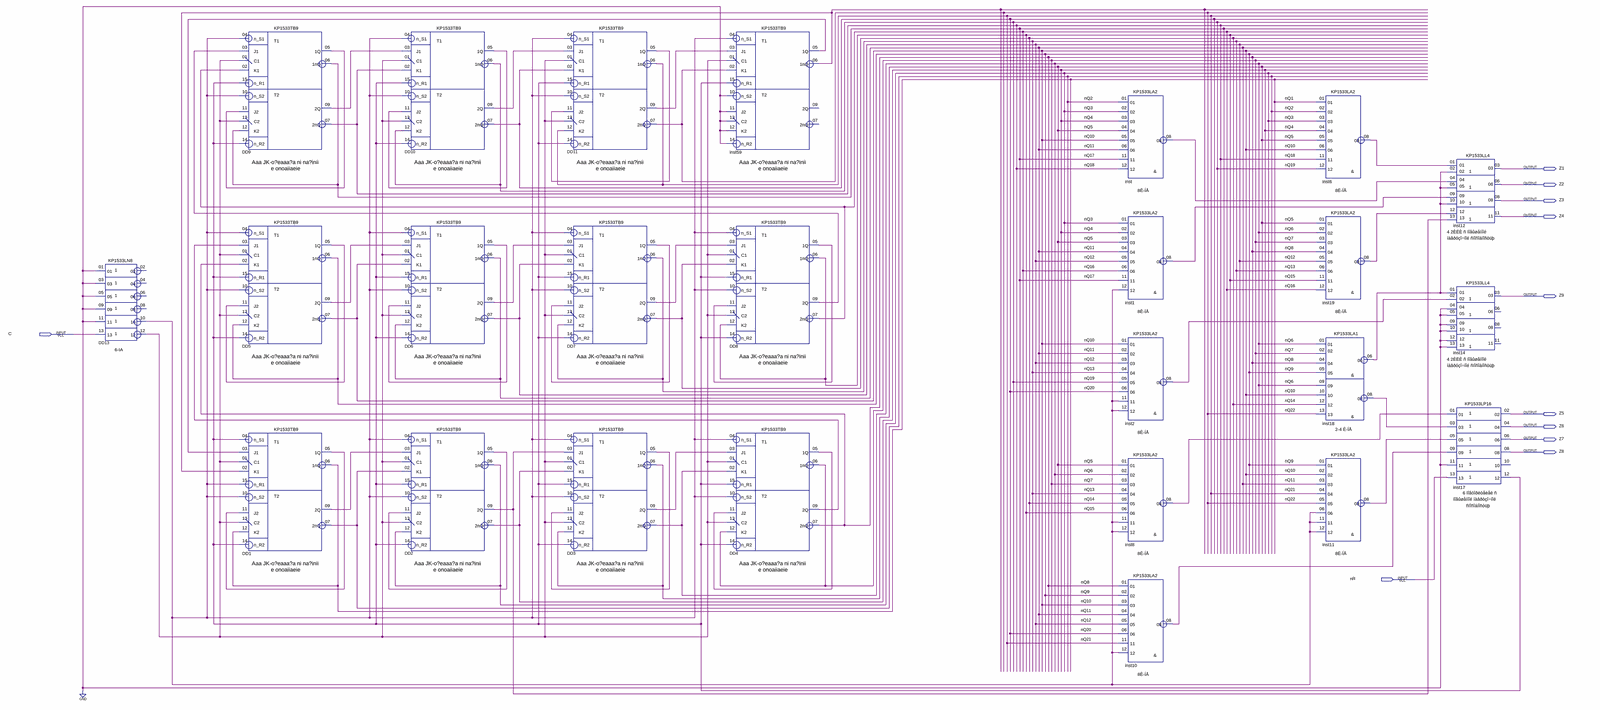
[diagram p0: schematic sheet, whole]
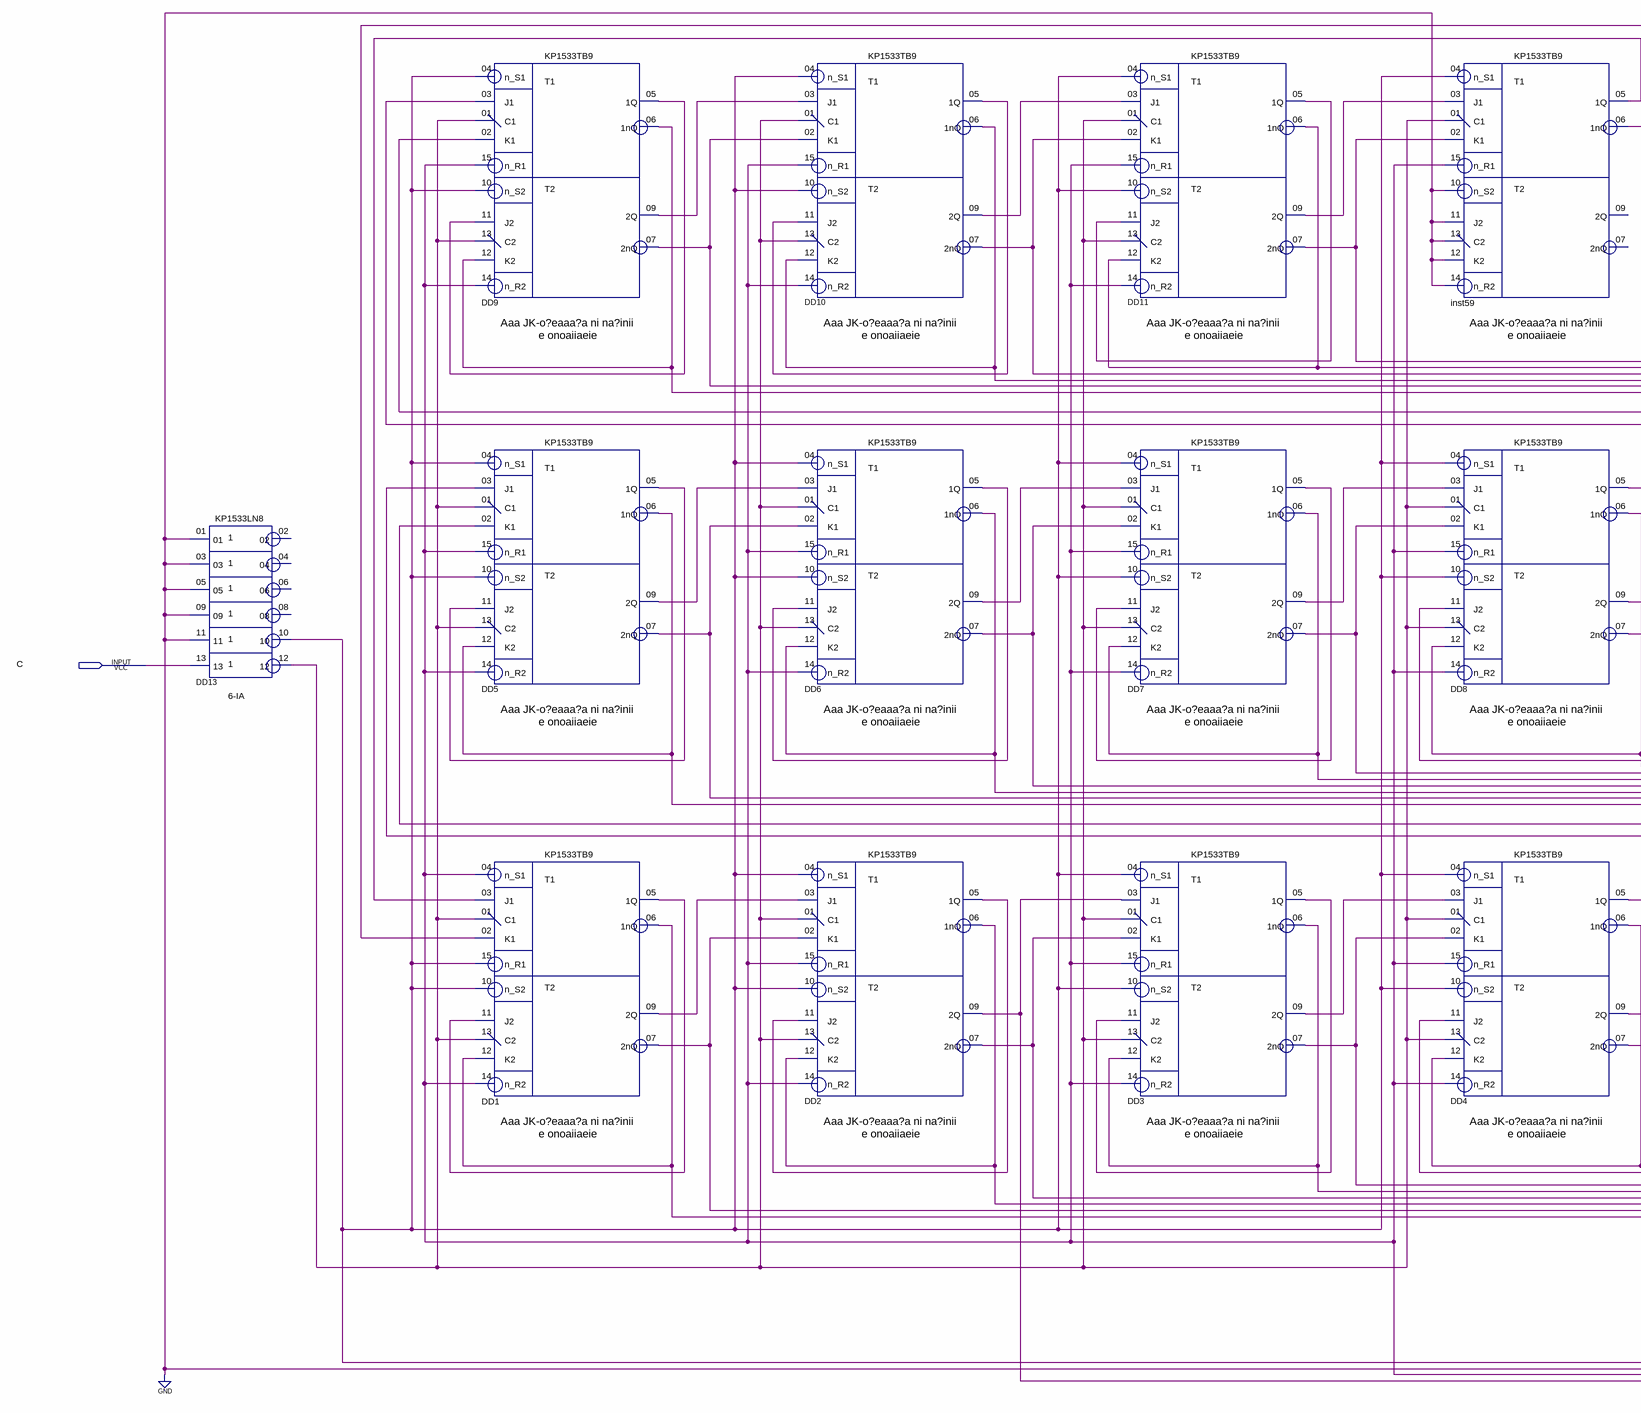
[diagram p1: schematic sheet, left part]
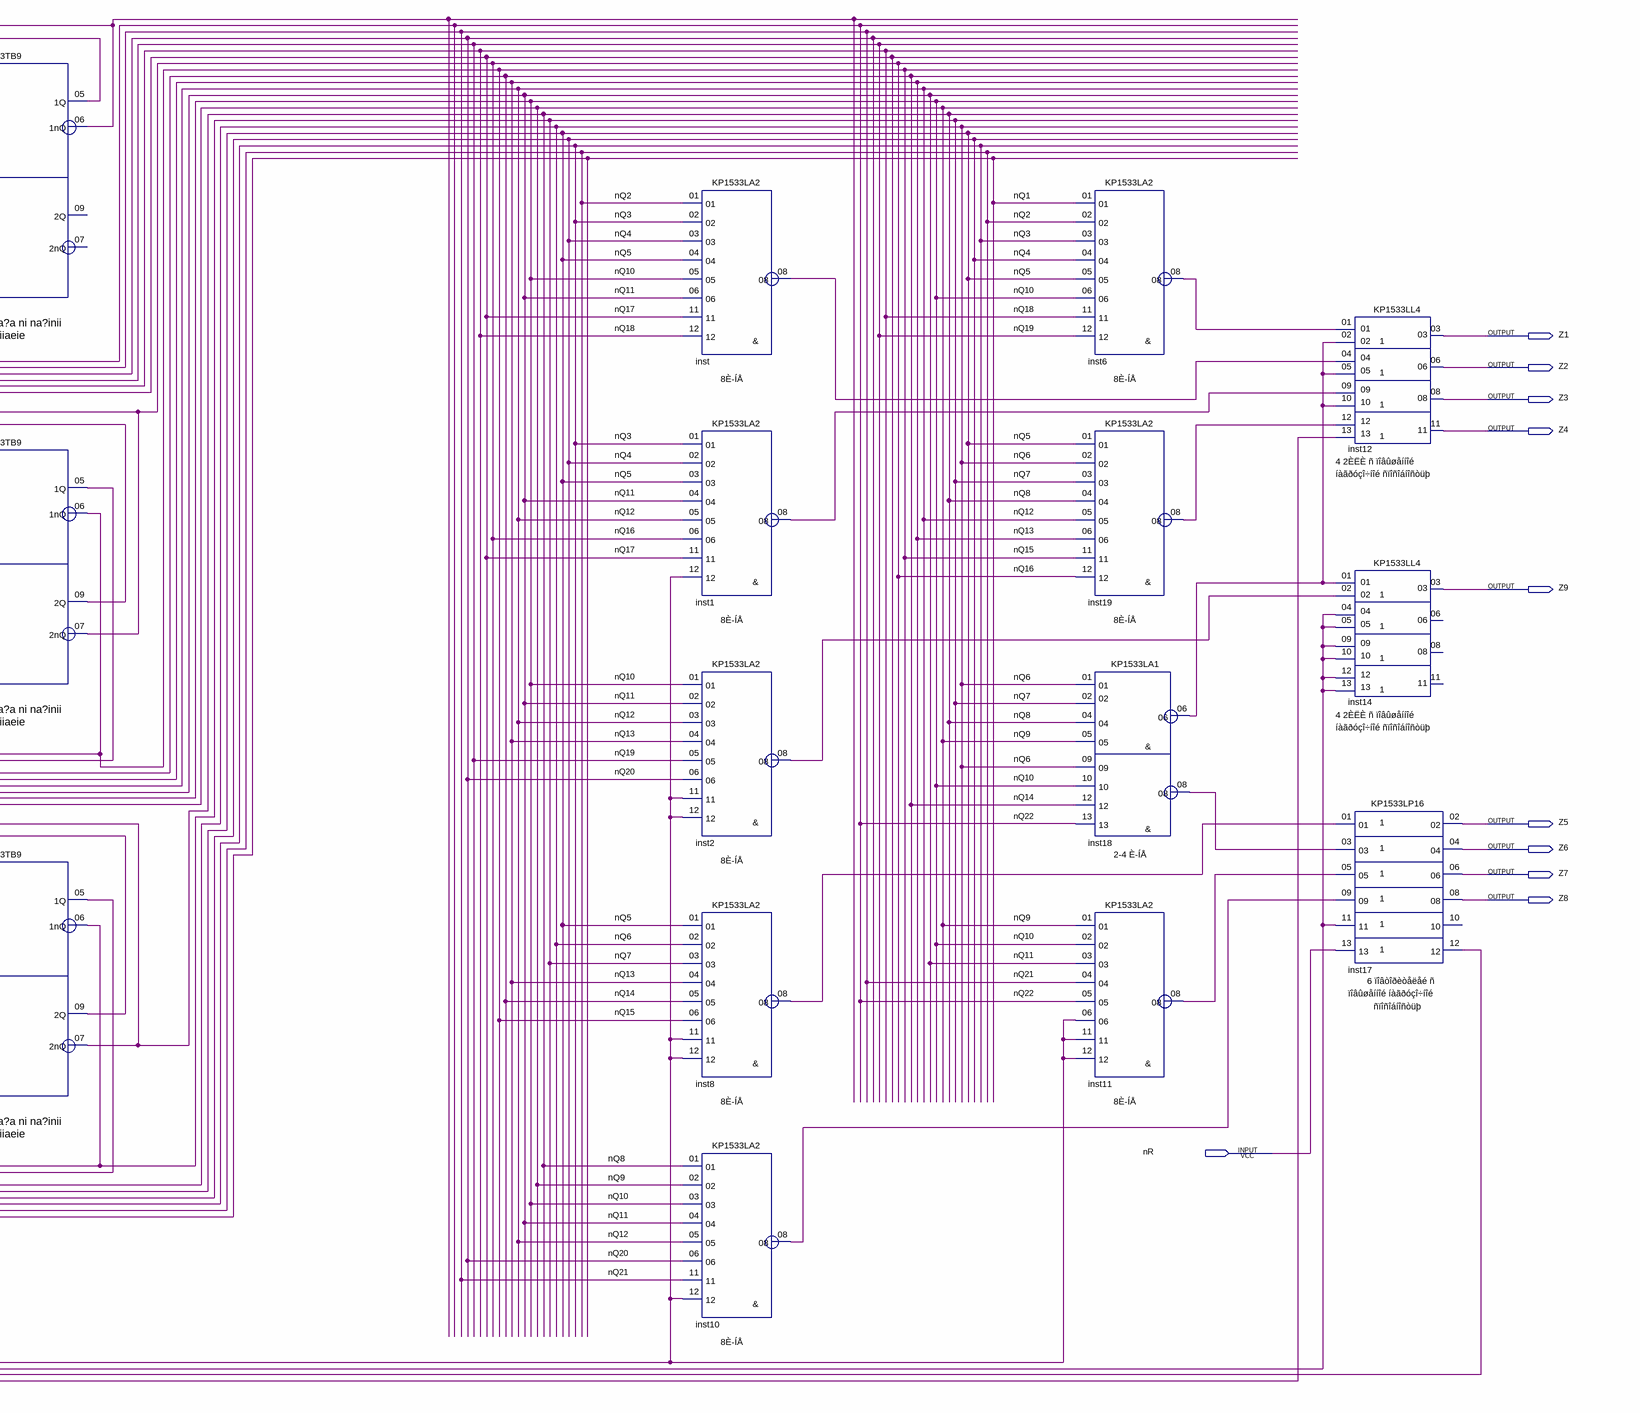
[diagram p2: schematic sheet, right part]
// Quartus schematic _PK_NAND.bdf as structural Verilog: 25 symbols, 11 pins
module _PK_NAND (
  input  C,
  input  nR,
  output Z1,
  output Z2,
  output Z3,
  output Z4,
  output Z9,
  output Z5,
  output Z6,
  output Z7,
  output Z8
);

  wire DD1_1q, DD1_2q, DD2_1q, DD2_2q, DD3_1q, DD3_2q, DD4_1q, DD4_2q, DD5_1q, DD5_2q, DD6_1q, DD6_2q,
       DD7_1q, DD7_2q, DD8_1q, DD8_2q, DD9_1q, DD9_2q, DD10_1q, DD10_2q, DD11_1q, DD11_2q, DD13_10, DD13_12,
       inst1_08, inst2_08, inst6_08, inst8_08, inst10_08, inst11_08, inst17_12, inst18_06, inst18_08,
       inst19_08, inst59_1nq, inst59_1q, inst_08, nQ1, nQ2, nQ3, nQ4, nQ5, nQ6, nQ7, nQ8, nQ9, nQ10, nQ11,
       nQ12, nQ13, nQ14, nQ15, nQ16, nQ17, nQ18, nQ19, nQ20, nQ21, nQ22;

  KP1533LN8 DD13 (
    .\01 (1'b0), .\03 (1'b0), .\05 (1'b0), .\09 (1'b0), .\11 (1'b0), .\13 (C), .\10 (DD13_10), .\12 (DD13_12));  // open: 02, 04, 06, 08
  KP1533TB9 DD9 (
    .n_S1(DD13_10), .J1(DD8_2q), .n_R1(inst17_12), .C1(DD13_12), .K1(nQ16), .n_S2(DD13_10), .J2(DD9_1q),
    .n_R2(inst17_12), .C2(DD13_12), .K2(nQ17), .\1Q (DD9_1q), .\1nQ (nQ17), .\2Q (DD9_2q), .\2nQ (nQ18));
  KP1533TB9 DD5 (
    .n_S1(DD13_10), .J1(DD4_2q), .n_R1(inst17_12), .C1(DD13_12), .K1(nQ8), .n_S2(DD13_10), .J2(DD5_1q),
    .n_R2(inst17_12), .C2(DD13_12), .K2(nQ9), .\1Q (DD5_1q), .\1nQ (nQ9), .\2Q (DD5_2q), .\2nQ (nQ10));
  KP1533TB9 DD1 (
    .n_S1(inst17_12), .J1(inst59_1q), .n_R1(DD13_10), .C1(DD13_12), .K1(inst59_1nq), .n_S2(DD13_10),
    .J2(DD1_1q), .n_R2(inst17_12), .C2(DD13_12), .K2(nQ1), .\1Q (DD1_1q), .\1nQ (nQ1), .\2Q (DD1_2q),
    .\2nQ (nQ2));
  KP1533TB9 DD10 (
    .n_S1(DD13_10), .J1(DD9_2q), .n_R1(inst17_12), .C1(DD13_12), .K1(nQ18), .n_S2(DD13_10), .J2(DD10_1q),
    .n_R2(inst17_12), .C2(DD13_12), .K2(nQ19), .\1Q (DD10_1q), .\1nQ (nQ19), .\2Q (DD10_2q), .\2nQ (nQ20));
  KP1533TB9 DD6 (
    .n_S1(DD13_10), .J1(DD5_2q), .n_R1(inst17_12), .C1(DD13_12), .K1(nQ10), .n_S2(DD13_10), .J2(DD6_1q),
    .n_R2(inst17_12), .C2(DD13_12), .K2(nQ11), .\1Q (DD6_1q), .\1nQ (nQ11), .\2Q (DD6_2q), .\2nQ (nQ12));
  KP1533TB9 DD2 (
    .n_S1(DD13_10), .J1(DD1_2q), .n_R1(inst17_12), .C1(DD13_12), .K1(nQ2), .n_S2(DD13_10), .J2(DD2_1q),
    .n_R2(inst17_12), .C2(DD13_12), .K2(nQ3), .\1Q (DD2_1q), .\1nQ (nQ3), .\2Q (DD2_2q), .\2nQ (nQ4));
  KP1533TB9 DD11 (
    .n_S1(DD13_10), .J1(DD10_2q), .n_R1(inst17_12), .C1(DD13_12), .K1(nQ20), .n_S2(DD13_10), .J2(DD11_1q),
    .n_R2(inst17_12), .C2(DD13_12), .K2(nQ21), .\1Q (DD11_1q), .\1nQ (nQ21), .\2Q (DD11_2q), .\2nQ (nQ22));
  KP1533TB9 DD7 (
    .n_S1(DD13_10), .J1(DD6_2q), .n_R1(inst17_12), .C1(DD13_12), .K1(nQ12), .n_S2(DD13_10), .J2(DD7_1q),
    .n_R2(inst17_12), .C2(DD13_12), .K2(nQ13), .\1Q (DD7_1q), .\1nQ (nQ13), .\2Q (DD7_2q), .\2nQ (nQ14));
  KP1533TB9 DD3 (
    .n_S1(DD13_10), .J1(DD2_2q), .n_R1(inst17_12), .C1(DD13_12), .K1(nQ4), .n_S2(DD13_10), .J2(DD3_1q),
    .n_R2(inst17_12), .C2(DD13_12), .K2(nQ5), .\1Q (DD3_1q), .\1nQ (nQ5), .\2Q (DD3_2q), .\2nQ (nQ6));
  KP1533TB9 inst59 (
    .n_S1(DD13_10), .J1(DD11_2q), .n_R1(inst17_12), .C1(DD13_12), .K1(nQ22), .n_S2(1'b0), .J2(1'b0),
    .n_R2(1'b0), .C2(1'b0), .K2(1'b0), .\1Q (inst59_1q), .\1nQ (inst59_1nq));  // open: 2Q, 2nQ
  KP1533TB9 DD8 (
    .n_S1(DD13_10), .J1(DD7_2q), .n_R1(inst17_12), .C1(DD13_12), .K1(nQ14), .n_S2(DD13_10), .J2(DD8_1q),
    .n_R2(inst17_12), .C2(DD13_12), .K2(nQ15), .\1Q (DD8_1q), .\1nQ (nQ15), .\2Q (DD8_2q), .\2nQ (nQ16));
  KP1533TB9 DD4 (
    .n_S1(DD13_10), .J1(DD3_2q), .n_R1(inst17_12), .C1(DD13_12), .K1(nQ6), .n_S2(DD13_10), .J2(DD4_1q),
    .n_R2(inst17_12), .C2(DD13_12), .K2(nQ7), .\1Q (DD4_1q), .\1nQ (nQ7), .\2Q (DD4_2q), .\2nQ (nQ8));
  KP1533LA2 inst (
    .\01 (nQ2), .\02 (nQ3), .\03 (nQ4), .\04 (nQ5), .\05 (nQ10), .\06 (nQ11), .\11 (nQ17), .\12 (nQ18),
    .\08 (inst_08));
  KP1533LA2 inst1 (
    .\01 (nQ3), .\02 (nQ4), .\03 (nQ5), .\04 (nQ11), .\05 (nQ12), .\06 (nQ16), .\11 (nQ17), .\12 (DD13_10),
    .\08 (inst1_08));
  KP1533LA2 inst2 (
    .\01 (nQ10), .\02 (nQ11), .\03 (nQ12), .\04 (nQ13), .\05 (nQ19), .\06 (nQ20), .\11 (DD13_10),
    .\12 (DD13_10), .\08 (inst2_08));
  KP1533LA2 inst8 (
    .\01 (nQ5), .\02 (nQ6), .\03 (nQ7), .\04 (nQ13), .\05 (nQ14), .\06 (nQ15), .\11 (DD13_10),
    .\12 (DD13_10), .\08 (inst8_08));
  KP1533LA2 inst10 (
    .\01 (nQ8), .\02 (nQ9), .\03 (nQ10), .\04 (nQ11), .\05 (nQ12), .\06 (nQ20), .\11 (nQ21), .\12 (DD13_10),
    .\08 (inst10_08));
  KP1533LA2 inst6 (
    .\01 (nQ1), .\02 (nQ2), .\03 (nQ3), .\04 (nQ4), .\05 (nQ5), .\06 (nQ10), .\11 (nQ18), .\12 (nQ19),
    .\08 (inst6_08));
  KP1533LA2 inst19 (
    .\01 (nQ5), .\02 (nQ6), .\03 (nQ7), .\04 (nQ8), .\05 (nQ12), .\06 (nQ13), .\11 (nQ15), .\12 (nQ16),
    .\08 (inst19_08));
  KP1533LA1 inst18 (
    .\01 (nQ6), .\02 (nQ7), .\04 (nQ8), .\05 (nQ9), .\09 (nQ6), .\10 (nQ10), .\12 (nQ14), .\13 (nQ22),
    .\06 (inst18_06), .\08 (inst18_08));
  KP1533LA2 inst11 (
    .\01 (nQ9), .\02 (nQ10), .\03 (nQ11), .\04 (nQ21), .\05 (nQ22), .\06 (DD13_10), .\11 (DD13_10),
    .\12 (DD13_10), .\08 (inst11_08));
  KP1533LL4 inst12 (
    .\01 (inst6_08), .\02 (inst18_06), .\04 (inst_08), .\05 (inst18_06), .\09 (inst1_08), .\10 (inst18_06),
    .\12 (inst19_08), .\13 (DD2_2q), .\03 (Z1), .\06 (Z2), .\08 (Z3), .\11 (Z4));
  KP1533LL4 inst14 (
    .\01 (inst18_06), .\02 (inst2_08), .\04 (1'b0), .\05 (1'b0), .\09 (1'b0), .\10 (1'b0), .\12 (1'b0),
    .\13 (1'b0), .\03 (Z9));  // open: 06, 08, 11
  KP1533LP16 inst17 (
    .\01 (inst8_08), .\03 (inst18_08), .\05 (inst11_08), .\09 (inst10_08), .\11 (1'b0), .\13 (nR), .\02 (Z5),
    .\04 (Z6), .\06 (Z7), .\08 (Z8), .\12 (inst17_12));  // open: 10
endmodule
